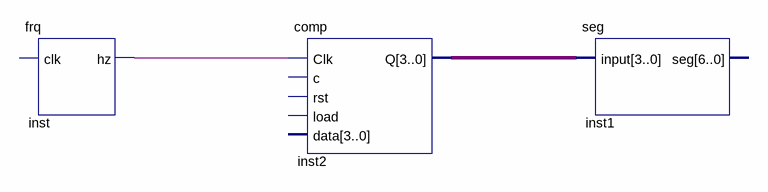
[diagram p0: schematic sheet]
// Quartus schematic Test.bdf as structural Verilog: 3 symbols, 0 pins
module Test (
);

  wire inst_hz;
  wire [3:0] inst2_q;

  frq inst (.hz(inst_hz));  // open: clk
  comp inst2 (.Clk(inst_hz), .Q(inst2_q));  // open: c, rst, load, data
  seg inst1 (.\input (inst2_q));  // open: seg
endmodule
